# Altium schematic sheet uc1B.SchDoc: Microcontroller 1 (Part B)
size A4; Author: Marcel Hellwig; Organization: Hamburg Bit-Bots; Address1: Vogt-Kölln-Str. 30; Address2: 22527 Hamburg; Address3: Germany; Address4: www.bit-bots.de; DocumentNumber: 4; Revision: A; SheetNumber: 4; SheetTotal: 16; EMail: info@bit-bots.de
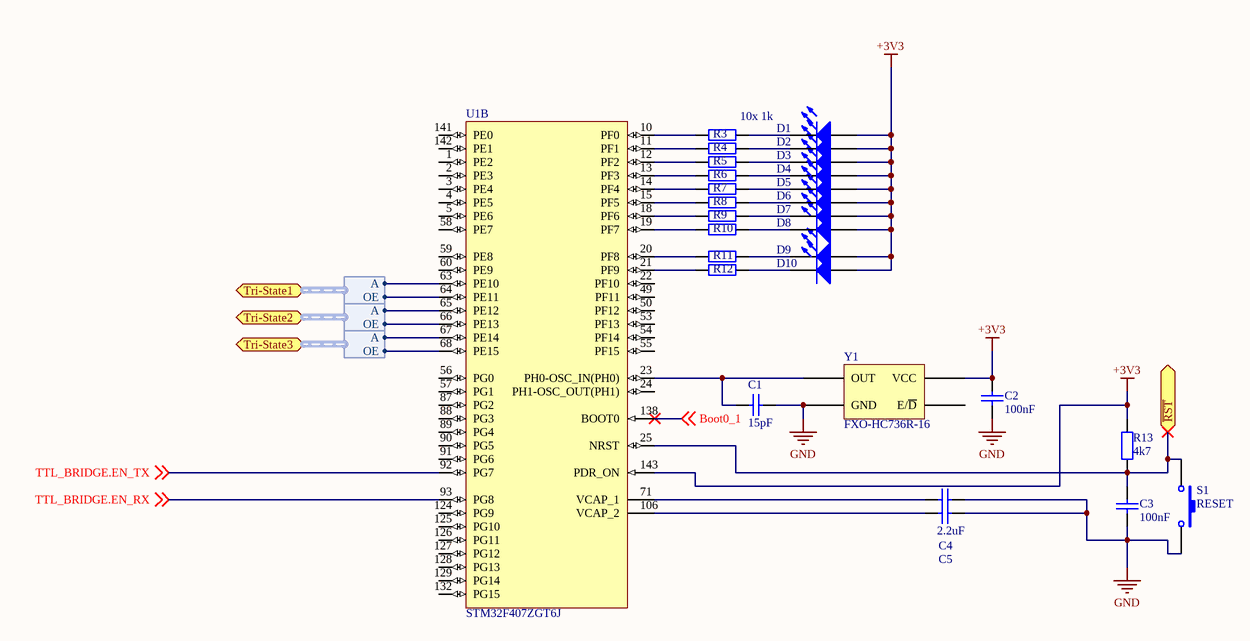
[diagram p0: uc1B.SchDoc]

## Parts
C1  15pF  [C2012]
C2  100nF  [C2012]
C3  100nF  [C2012]
C4  2.2uF  [C2012]  (value not drawn)
C5  2.2uF  [C2012]
D1  Green  [MLCC2]  (value not drawn)
D2  Green  [MLCC2]  (value not drawn)
D3  Green  [MLCC2]  (value not drawn)
D4  Green  [MLCC2]  (value not drawn)
D5  Green  [MLCC2]  (value not drawn)
D6  Green  [MLCC2]  (value not drawn)
D7  Green  [MLCC2]  (value not drawn)
D8  Green  [MLCC2]  (value not drawn)
D9  Green  [MLCC2]  (value not drawn)
D10  Green  [MLCC2]  (value not drawn)
R3  1k  [R2012]  (value not drawn)
R4  1k  [R2012]  (value not drawn)
R5  1k  [R2012]  (value not drawn)
R6  1k  [R2012]  (value not drawn)
R7  1k  [R2012]  (value not drawn)
R8  1k  [R2012]  (value not drawn)
R9  1k  [R2012]  (value not drawn)
R10  1k  [R2012]  (value not drawn)
R11  1k  [R2012]  (value not drawn)
R12  1k  [R2012]  (value not drawn)
R13  4k7  [R2012]
S1  RESET  [SWITCH]
U1  STM32F407ZGT6J  [STM-LQFP144_M]  (part B of 3)
Y1  FXO-HC736R-16  [FXO-HC73]

## Ports
Tri-State1 (harness Tri-State), Tri-State2 (harness Tri-State), Tri-State3 (harness Tri-State), ~{RST}

## Harnesses
Tri-State: A, OE

## Nets
+3V3: C2.1 D1.1(A) D2.1(A) D3.1(A) D4.1(A) D5.1(A) D6.1(A) D7.1(A) D8.1(A) D9.1(A) D10.1(A) R13.1 U1.143(PDR_ON) Y1.4(VCC)
GND: C1.1 C2.2 C3.1 C4.2 C5.2 S1.2 Y1.2(GND)
~{RST}: C3.2 R13.2 S1.1 U1.25(NRST) ; port ~{RST}
Boot0_1: U1.138(BOOT0) ; off-sheet Boot0_1
TTL_BRIDGE.EN_RX: U1.93(PG8) ; off-sheet TTL_BRIDGE.EN_RX
TTL_BRIDGE.EN_TX: U1.92(PG7) ; off-sheet TTL_BRIDGE.EN_TX
NetC1_2: C1.2 U1.23(PH0-OSC_IN(PH0)) Y1.3(OUT)
NetC4_1: C4.1 U1.71(VCAP_1)
NetC5_1: C5.1 U1.106(VCAP_2)
NetD1_2: D1.2(K) R3.2
NetD2_2: D2.2(K) R4.2
NetD3_2: D3.2(K) R5.2
NetD4_2: D4.2(K) R6.2
NetD5_2: D5.2(K) R7.2
NetD6_2: D6.2(K) R8.2
NetD7_2: D7.2(K) R9.2
NetD8_2: D8.2(K) R10.2
NetD9_2: D9.2(K) R11.2
NetD10_2: D10.2(K) R12.2
NetR3_1: R3.1 U1.10(PF0)
NetR4_1: R4.1 U1.11(PF1)
NetR5_1: R5.1 U1.12(PF2)
NetR6_1: R6.1 U1.13(PF3)
NetR7_1: R7.1 U1.14(PF4)
NetR8_1: R8.1 U1.15(PF5)
NetR9_1: R9.1 U1.18(PF6)
NetR10_1: R10.1 U1.19(PF7)
NetR11_1: R11.1 U1.20(PF8)
NetR12_1: R12.1 U1.21(PF9)
NetU1_63: U1.63(PE10) ; port Tri-State1.A
NetU1_64: U1.64(PE11) ; port Tri-State1.OE
NetU1_65: U1.65(PE12) ; port Tri-State2.A
NetU1_66: U1.66(PE13) ; port Tri-State2.OE
NetU1_67: U1.67(PE14) ; port Tri-State3.A
NetU1_68: U1.68(PE15) ; port Tri-State3.OE

Not connected (* = marked no-connect by the designer): U1 1(PE2) 2(PE3) 3(PE4) 4(PE5) 5(PE6) 22(PF10) 24(PH1-OSC_OUT(PH1)) 49(PF11) 50(PF12) 53(PF13) 54(PF14) 55(PF15) 56(PG0) 57(PG1) 58(PE7) 59(PE8) 60(PE9) 87(PG2) 88(PG3) 89(PG4) 90(PG5) 91(PG6) 124(PG9) 125(PG10) 126(PG11) 127(PG12) 128(PG13) 129(PG14) 132(PG15) 141(PE0) 142(PE1); Y1 1(E/~{D})

## Notes on the sheet
- (near R3) 10x 1k
- Project:
- Author:
- Title:
- Rev:
- Date:
- Time:
- Sheet
- of

## Library data of the parts
C1 = Cap: Capacitor; Manufacturer: MULTICOMP; Manufacturer Part Number: MC0805N150J500CT; Produktpalette: Baureihe MC; Kapazität: 15; Kapazitätstoleranz: ±5%; Dielektrikum: C0G / NP0; Nennspannung: 50; Keramikkondensatorgehäuse: 0805 [Metrisch 2012]; Betriebstemperatur, min.: -55; Betriebstemperatur, max.: 125; Verpackung: Gurtabschnitt; SVHC: No SVHC (17-Dec-2014); Betriebstemperatur: -55°C bis +125; Kondensatoranschlüsse: SMD<!--FANDB--><div class="features-and-benefits-container"></div>; Published: 8-Jun-2000; LatestRevisionDate: 17-Jul-2002; LatestRevisionNote: Re-released for DXP Platform.; PackageReference: RAD-0.3; Publisher: Altium Limited; PackageDescription: Radial Cap, Thru-Hole; 2 Leads; 0.3 in Pin Spacing; Value: 15pF; Supplier 1: Farnell; Supplier Part Number 1: 1759193; RoHS: YES; Stock 1: 38433; Pricing 1: 10=0,021, 100=0,017, 500=0,014, 1000=0,012, 2000=0,009 (EUR); MSL: -; Bauform: 0805 [Metrisch 2012]; Kapazitätstoleranz ±: ±5%; ComponentLink1URL: http://www.farnell.com/datasheets/1870456.pdf; ComponentLink1Description: http://www.farnell.com/datasheets/1870456.pdf
C2 = Cap: Capacitor; Published: 8-Jun-2000; LatestRevisionDate: 17-Jul-2002; LatestRevisionNote: Re-released for DXP Platform.; PackageReference: RAD-0.3; Publisher: Altium Limited; PackageDescription: Radial Cap, Thru-Hole; 2 Leads; 0.3 in Pin Spacing; Value: 100nF; Supplier 1: Farnell; Supplier Part Number 1: 1759265
C3 = Cap: Capacitor; Manufacturer: MULTICOMP; Manufacturer Part Number: MC0805B104K500CT; Produktpalette: Baureihe MC; Kapazität: 0.1; Kapazitätstoleranz: ±10%; Dielektrikum: X7; Nennspannung: 50; Keramikkondensatorgehäuse: 0805 [Metrisch 2012]; Betriebstemperatur, min.: -55; Betriebstemperatur, max.: 125; Verpackung: Gurtabschnitt; SVHC: No SVHC (17-Dec-2014); Betriebstemperatur: -55°C bis +125; Kondensatoranschlüsse: SMD<!--FANDB--><div class="features-and-benefits-container"></div>; Published: 8-Jun-2000; LatestRevisionDate: 17-Jul-2002; LatestRevisionNote: Re-released for DXP Platform.; PackageReference: RAD-0.3; Publisher: Altium Limited; PackageDescription: Radial Cap, Thru-Hole; 2 Leads; 0.3 in Pin Spacing; Value: 100nF; Supplier 1: Farnell; Supplier Part Number 1: 1759265; RoHS: YES; Stock 1: 692587; Pricing 1: 10=0,013, 100=0,011, 500=0,009, 1000=0,008, 2000=0,006 (EUR); MSL: -; Bauform: 0805 [Metrisch 2012]; Kapazitätstoleranz ±: ±10%; ComponentLink1URL: http://www.farnell.com/datasheets/1870456.pdf; ComponentLink1Description: http://www.farnell.com/datasheets/1870456.pdf
C4 C5 = Cap: Capacitor; Manufacturer: MULTICOMP; Manufacturer Part Number: MC0805B225K250CT; Produktpalette: Baureihe MC; Kapazität: 2.2; Kapazitätstoleranz: ±10%; Dielektrikum: X7; Nennspannung: 25; Keramikkondensatorgehäuse: 0805 [Metrisch 2012]; Betriebstemperatur, min.: -55; Betriebstemperatur, max.: 125; Verpackung: Gurtabschnitt; Kondensatoranschlüsse: SMD<!--FANDB--><div class="features-and-benefits-container"></div>; Published: 8-Jun-2000; LatestRevisionDate: 17-Jul-2002; LatestRevisionNote: Re-released for DXP Platform.; PackageReference: RAD-0.3; Publisher: Altium Limited; PackageDescription: Radial Cap, Thru-Hole; 2 Leads; 0.3 in Pin Spacing; Value: 2.2uF; Supplier 1: Farnell; Supplier Part Number 1: 2320829; RoHS: YES; Stock 1: 13870; Pricing 1: 10=0,101, 100=0,084, 500=0,071, 1000=0,058, 1500=0,046 (EUR); MSL: MSL 1 - unbegrenzt; Bauform: 0805 [Metrisch 2012]; Kapazitätstoleranz ±: ±10%; ComponentLink1URL: http://www.farnell.com/datasheets/1870456.pdf; ComponentLink1Description: http://www.farnell.com/datasheets/1870456.pdf
D1-D10 = LED0: Typical INFRARED GaAs LED; Manufacturer: VISHAY; Manufacturer Part Number: VLMC3100-GS08; Leuchtengröße: 2.4; LED-Farbe: Grün; Lichtstärke: 1.6; Abstrahlwinkel: 120°; Durchlassstrom If: 2; Durchlassspannung: 1.9; LED-Montage: Oberflächenmontage; Linsenform: Rund; Wellenlänge, typ.: 575; Verpackung: Gurtabschnitt; SVHC: No SVHC (16-Jun-2014); Betriebstemperatur: -40°C bis +100; Betriebstemperatur, max.: 100; Betriebstemperatur, min.: -40; LED-Typ: Standard; LED/Lampen Größe: PLCC-2; Montage: SMD; Sperrspannung: 6; Spitzenwellenlänge: 565; Winkel halber Empfindlichkeit ±: 60; Published: 8-Jun-2000; LatestRevisionDate: 08-Jul-2005; LatestRevisionNote: Mech Layer 1 removed.; PackageReference: LED-0; Publisher: Altium Limited; PackageDescription: LED; 2 Leads; Supplier 1: Farnell; Supplier Part Number 1: 1659076; RoHS: YES; Stock 1: 12975; Pricing 1: 5=0,105, 25=0,0998, 100=0,0952, 250=0,0917, 500=0,0865, 2000=0,0771, 4000=0,0717, 20000=0,0689 (EUR); MSL: MSL 2A - 4 Wochen; Anzahl der Pins: 2; Dominante Wellenlänge: 575; Durchlassspannung Vf max.: 2.4; Durchlassstrom If, max.: 2; Lichtstärke, typ.: 1.6; ComponentLink1URL: http://www.farnell.com/datasheets/1698102.pdf; ComponentLink1Description: http://www.farnell.com/datasheets/1698102.pdf
R3-R12 = Res2: Resistor; Manufacturer: MULTICOMP; Manufacturer Part Number: MC01W0805110K; Published: 8-Jun-2000; LatestRevisionDate: 17-Jul-2002; LatestRevisionNote: Re-released for DXP Platform.; PackageReference: AXIAL-0.4; Publisher: Altium Limited; PackageDescription: Axial Device, Thru-Hole; 2 Leads; 0.4 in Pin Spacing; Value: 1k; Supplier 1: Farnell; Supplier Part Number 1: 9332391; RoHS: Y-EX; Stock 1: 4370; Pricing 1: 50=0,038, 250=0,031, 1000=0,022, 5000=0,014, 15000=0,009 (EUR); ComponentLink1URL: http://www.farnell.com/datasheets/1729047.pdf; ComponentLink1Description: http://www.farnell.com/datasheets/1729047.pdf; ComponentLink2URL: http://www.farnell.com/cad/1561156.zip; ComponentLink2Description: http://www.farnell.com/cad/1561156.zip
R13 = Res2: Resistor; Manufacturer: MULTICOMP; Manufacturer Part Number: MC01W080514K7; Produktpalette: Baureihe MC; Widerstand: 4.7; Nennleistung: 100; Widerstandstoleranz: ±1%; Bauform: 0805 [Metrisch 2012]; Widerstandselement: Dickschicht; Temperaturkoeffizient: ±100; Nennspannung: 150; Verpackung: Gurtabschnitt; SVHC: No SVHC (17-Dec-2014); Anzahl der Pins: 2; Außenbreite: 1.25; Außentiefe: 0.55; Bandbreite: 8; Baureihe: MC; Betriebstemperatur: -55°C bis +155; Betriebstemperatur, max.: 155; Betriebstemperatur, min.: -55; Menge pro Rolle: 5000; Toleranz (+): 1%; Widerstandsmontage: Oberflächenmontage<!--FANDB--><div class="features-and-benefits-container"></div>; Published: 8-Jun-2000; LatestRevisionDate: 17-Jul-2002; LatestRevisionNote: Re-released for DXP Platform.; PackageReference: AXIAL-0.4; Publisher: Altium Limited; PackageDescription: Axial Device, Thru-Hole; 2 Leads; 0.4 in Pin Spacing; Value: 4k7; Supplier 1: Farnell; Supplier Part Number 1: 9333266; RoHS: Y-EX; Stock 1: 190984; Pricing 1: 50=0,038, 250=0,031, 1000=0,022, 5000=0,014, 15000=0,009 (EUR); MSL: -; Außenlänge/-höhe: 2; Nennspannung, V DC: 150; Temperaturkoeffizient, +: 100; Temperaturkoeffizient, -: 100; Toleranz (-): 1%; ComponentLink1URL: http://www.farnell.com/datasheets/1729047.pdf; ComponentLink1Description: http://www.farnell.com/datasheets/1729047.pdf; ComponentLink2URL: http://www.farnell.com/cad/1561170.zip; ComponentLink2Description: http://www.farnell.com/cad/1561170.zip
S1 = SW-PB: Switch; Published: 24-Mar-1999; LatestRevisionDate: 17-Jul-2002; LatestRevisionNote: Re-released for DXP Platform.; PackageReference: SPST-2; Publisher: Altium Limited; PackageDescription: Switch; 2 Leads; Supplier 1: Farnell; Supplier Part Number 1: 2396053
U1 = CMP-0243-00063-2: ARM Cortex-M4 32-bit MCU+FPU, 210 DMIPS, 1024 kB Flash, 192 kB Internal RAM, 114 I/Os, 144-pin LQFP, -40 to 85 degC, Tray; Manufacturer: STMicroelectronics; I/Os (High Current): 114; D/A Converter: 2x12-bit; Internal RAM Size (kB): 192; Operating Frequency(F) (Processor speed) (MHz): 168; Supply Voltage(Vcc) max (V): 3.6; Supply Voltage(Vcc) min (V): 1.8; FLASH Size (Prog) (kB): 1024; ComponentLink3Description: Package Specification; PackageVersion: Rev. 4, 06/2013; PartNumber: STM32F407ZGT6J; ComponentLink3URL: http://www.st.com/st-web-ui/static/active/en/resource/technical/document/datasheet/DM00037051.pdf; PackageReference: LQFP144; ComponentLink2URL: http://www.st.com/st-web-ui/static/active/en/resource/technical/document/datasheet/DM00037051.pdf; ComponentLink2Description: Datasheet; ComponentLink1Description: Manufacturer URL; Mounting Technology: Surface Mount; Core: ARM Cortex-M4; PackageDescription: 144-Pin Low Profile Quad Flat Package, 20 x 20 mm Body, 0.5 mm Pitch; Packing: Tray; ComponentLink1URL: http://www.st.com/web/en/home.html; DatasheetVersion: Rev. 4; PartId: 1; Supplier 1: Farnell; Supplier Part Number 1: 2333299
Y1 = Oszillator: Oscillator with Enable Input; Manufacturer: FOX ELECTRONICS; Produktpalette: Baureihe FXO-HC53; Nennfrequenz: 16; Frequenzstabilität + / -: 25; Versorgungsspannung, nom.: 3.3; Oszillatorgehäuse: SMD, 7mm x 5; Kompatibler Oszillatorausgang: HCMOS; Betriebstemperatur, min.: -40; Betriebstemperatur, max.: 85; SVHC: No SVHC (17-Dec-2014; Supplier 1: Farnell; Supplier Part Number 1: 1640997; Manufacturer Part Number: FXO-HC736R-16; RoHS: YES; Stock 1: 98; Pricing 1: 1=1,74, 25=1,71, 50=1,68, 100=1,65, 200=1,62, 700=1,59, 2000=1,56, 4000=1,52 (EUR); ComponentLink1URL: http://www.farnell.com/datasheets/75444.pdf; ComponentLink1Description: http://www.farnell.com/datasheets/75444.pdf